# EasyEDA Pro project ProDocument_PCB_PCB_消毒盒3.0_2023-10-11_2023-10-12.epro

# Board PCB_PCB_消毒盒3.0_2023-10-11
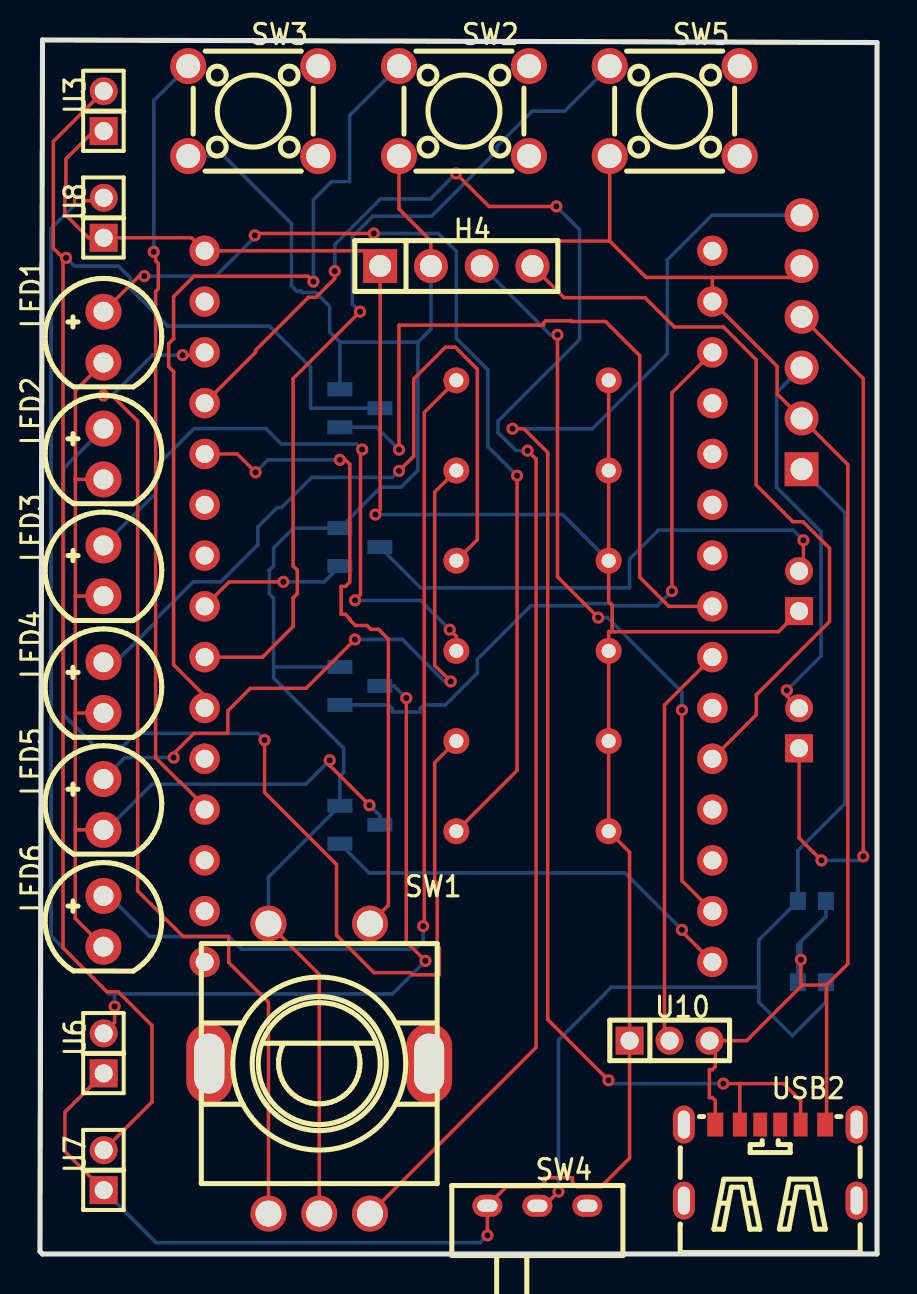
[diagram p0: board, top side]
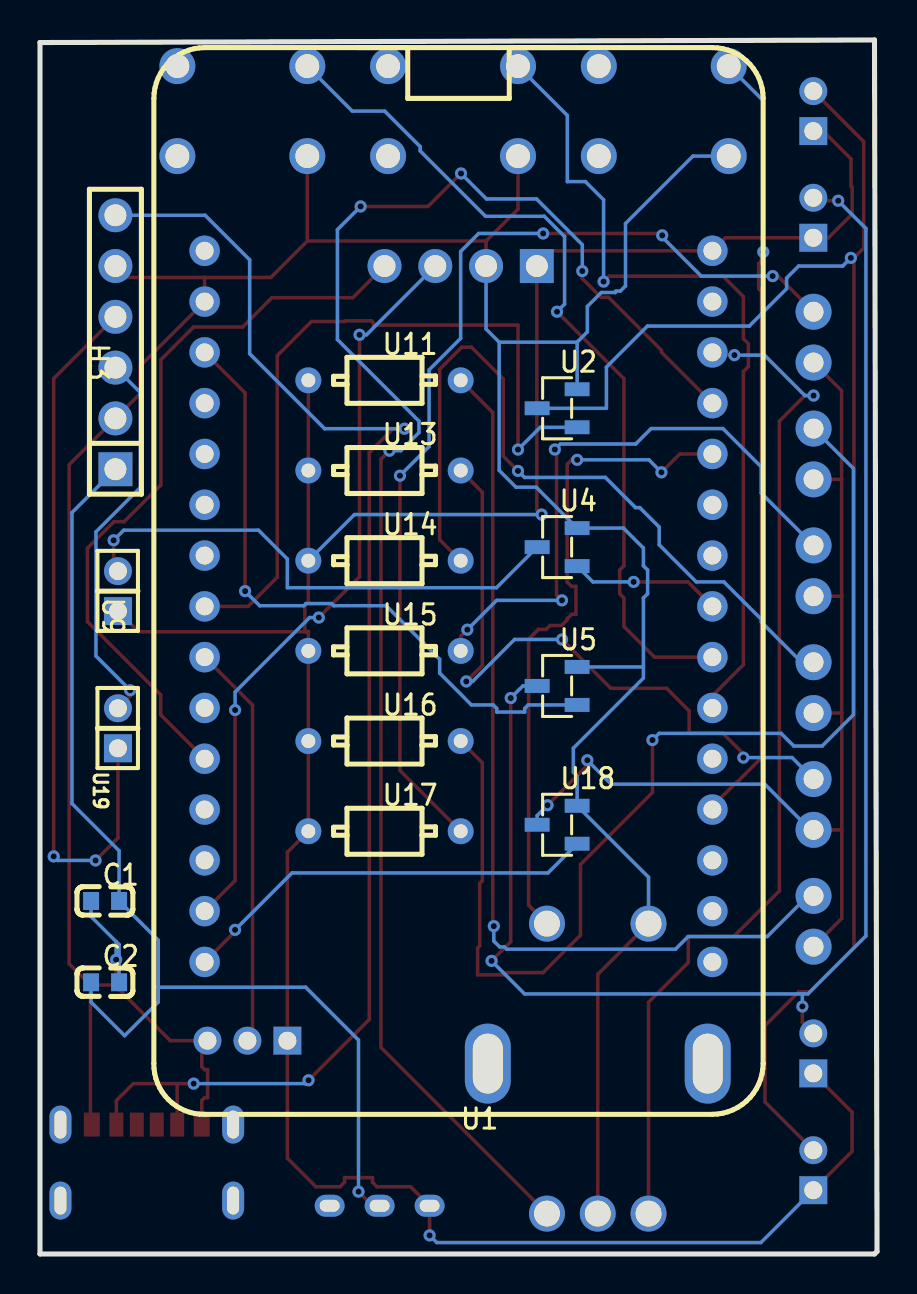
[diagram p1: board, bottom side, seen from below]

Outline 41.87 x 60.71 mm; copper layers: Top Layer, Bottom Layer. Coordinates in mm from the lower left corner of the outline.
Outline path: 0,0.13 0.12,58.77 0.13,60.71 41.87,60.58 41.87,0 0.13,0 0,0.13
Stack: Top Layer 0.035mm / Dielectric1 1.51mm FR4 er 4.5 / Bottom Layer 0.035mm

## Design rules (mm)
template: 用户自定义配置
spacing Default (default): track to track 0.152, other pairs 0 to 0.152
track width Default (default): min 0.178, default 0.178, max 25.4
differential pair differentialPair (default): width min 0.127, default 0.254, max 2.54; gap min 0.152, default 0.152
via Default (default): diameter min 0.61, default 0.61, max 100.025; hole min 0.305, default 0.305, max 59.995

## Placement (name value [footprint] x y rotation side)
C1  100nF  [C0603]  38.62 17.65 180 bottom
C2  10uF  [C0603]  38.62 13.59 180 bottom
H3  电源模块  [HDR-TH_6P-P2.54-V-M]  38.1 45.59 90 bottom
H4  1.3inch显示屏  [HDR-TH_4P-P2.54-V-M]  20.83 49.4 0 top
LED1  XL-502UBD  [LED-TH_BD5.9-P2.54-RD_BLUE]  3.17 45.85 90 top
LED2  XL-502UBD  [LED-TH_BD5.9-P2.54-RD_BLUE]  3.17 40 90 top
LED3  XL-502UBD  [LED-TH_BD5.9-P2.54-RD_BLUE]  3.17 34.16 90 top
LED4  XL-502UBD  [LED-TH_BD5.9-P2.54-RD_BLUE]  3.17 28.32 90 top
LED5  XL-502UBD  [LED-TH_BD5.9-P2.54-RD_BLUE]  3.17 22.48 90 top
LED6  XL-502UBD  [LED-TH_BD5.9-P2.54-RD_BLUE]  3.17 16.64 90 top
SW1  编码器  [SW-TH_EC11E18244A5]  13.97 9.27 0 top
SW2  B3F-1022  [SW-TH_4P-L6.0-W6.0-P4.50-LS6.5]  21.21 57.15 0 top
SW3  B3F-1022  [SW-TH_4P-L6.0-W6.0-P4.50-LS6.5]  10.67 57.15 0 top
SW4  总电源开关  [SW-TH_MK-12D18-G040]  24.88 2.41 0 top
SW5  B3F-1022  [SW-TH_4P-L6.0-W6.0-P4.50-LS6.5]  31.75 57.15 0 top
U1  NO  [ESP-WROOM-32]  8.24 14.6 0 bottom
U2  蓝色灯条MOS  [SOT-23-3_L2.9-W1.3-P1.90-LS2.4-BR]  16 42.29 180 bottom
U3  蓝色灯条  [HDR-TH_2P-P2.00-V-M]  3.19 57.15 90 top
U4  臭氧MOS  [SOT-23-3_L2.9-W1.3-P1.90-LS2.4-BR]  16 35.35 180 bottom
U5  白色灯条MOS  [SOT-23-3_L2.9-W1.3-P1.90-LS2.4-BR]  16 28.41 180 bottom
U6  白色灯条  [HDR-TH_2P-P2.00-V-M]  3.19 10.03 90 top
U7  蓝色灯条  [HDR-TH_2P-P2.00-V-M]  3.19 4.19 90 top
U8  白色灯条  [HDR-TH_2P-P2.00-V-M]  3.19 51.82 90 top
U9  臭氧  [HDR-TH_2P-P2.00-V-M]  37.97 33.15 90 bottom
U10  人体感应器  [HDR-TH_3P-P2.00-V-M]  31.5 10.67 0 top
U11  220Ω  [RES-TH_BD2.3-L3.7-P7.70-D0.9]  24.64 43.69 180 bottom
U13  220Ω  [RES-TH_BD2.3-L3.7-P7.70-D0.9]  24.64 39.18 180 bottom
U14  220Ω  [RES-TH_BD2.3-L3.7-P7.70-D0.9]  24.64 34.67 180 bottom
U15  220Ω  [RES-TH_BD2.3-L3.7-P7.70-D0.9]  24.64 30.16 180 bottom
U16  220Ω  [RES-TH_BD2.3-L3.7-P7.70-D0.9]  24.64 25.65 180 bottom
U17  220Ω  [RES-TH_BD2.3-L3.7-P7.70-D0.9]  24.64 21.14 180 bottom
U18  5N10_C5358569  [SOT-23-3_L2.9-W1.3-P1.90-LS2.4-BR]  16 21.46 180 bottom
U19  电池  [HDR-TH_2P-P2.00-V-M]  37.97 26.29 90 bottom
USB2  TYPE-C-2.0-6PIN  [TYPE-C-SMD_TYPE-C-6P-2]  36.53 4.57 0 top

## Footprints (pads in the part's own frame, mm; a bottom-side part is the same pattern mirrored in y, then rotated)
C0603
  rect 0.8x0.9 smd: 1(-0.7,0) 2(0.7,0)
ESP-WROOM-32
  round 1.524 hole 0.9: 1(0,0) 2(0,-2.54) 3(0,-5.08) 4(0,-7.62) 5(0,-10.16) 6(0,-12.7) 7(0,-15.24) 8(0,-17.78) 9(0,-20.32) 10(0,-22.86) 11(0,-25.4) 12(0,-27.94) 13(0,-30.48) 14(0,-33.02) 15(0,-35.56) 16(25.4,-35.56) 17(25.4,-33.02) 18(25.4,-30.48) 19(25.4,-27.94) 20(25.4,-25.4) 21(25.4,-22.86) 22(25.4,-20.32) 23(25.4,-17.78) 24(25.4,-15.24) 25(25.4,-12.7) 26(25.4,-10.16) 27(25.4,-7.62) 28(25.4,-5.08) 29(25.4,-2.54) 30(25.4,0)
HDR-TH_2P-P2.00-V-M
  rect 1.4x1.4 hole 0.9: 1(-1,0)
  round 1.4 hole 0.9: 2(1,0)
HDR-TH_3P-P2.00-V-M
  rect 1.4x1.4 hole 0.9: 1(-2,0)
  round 1.4 hole 0.9: 2(0,0) 3(2,0)
HDR-TH_4P-P2.54-V-M
  rect 1.7x1.7 hole 1.1: 1(-3.81,0)
  round 1.7 hole 1.1: 2(-1.27,0) 3(1.27,0) 4(3.81,0)
HDR-TH_6P-P2.54-V-M
  rect 1.7x1.7 hole 1.1: 1(-6.35,0)
  round 1.7 hole 1.1: 2(-3.81,0) 3(-1.27,0) 4(1.27,0) 5(3.81,0) 6(6.35,0)
LED-TH_BD5.9-P2.54-RD_BLUE
  round 1.8 hole 1: 1(-1.27,0) 2(1.27,0)
RES-TH_BD2.3-L3.7-P7.70-D0.9
  round 1.3 hole 0.7: 1(-3.81,0) 2(3.81,0)
SOT-23-3_L2.9-W1.3-P1.90-LS2.4-BR
  rect 1.25x0.7 smd: 1(1,-0.95) 2(1,0.95) 3(-1,0)
SW-TH_4P-L6.0-W6.0-P4.50-LS6.5
  round 1.8 hole 1.2: 1(-3.25,2.25) 2(3.25,2.25) 3(-3.25,-2.25) 4(3.25,-2.25)
SW-TH_EC11E18244A5
  oval 2.3x4 hole 1.5x3: 6(5.5,0.25) 7(-5.5,0.25)
  round 1.8 hole 1.3: A(-2.54,-7.25) B(2.54,-7.25) C(0,-7.25) D(-2.54,7.25) E(2.54,7.25)
SW-TH_MK-12D18-G040
  oval 1.5x1.1 hole 1x0.6: 1(-2.5,0) 2(0,0) 3(2.5,0)
TYPE-C-SMD_TYPE-C-6P-2
  oval 1.1x1.9 hole 0.6x1.4: 7(-4.32,1.9) 8(4.32,1.9) 9(-4.32,-1.9) 10(4.32,-1.9)
  rect 0.7x1.2 smd: A5(-0.5,1.9) A9(1.52,1.9) B5(0.5,1.9) B9(-1.52,1.9)
  rect 0.8x1.2 smd: A12(2.75,1.9) B12(-2.75,1.9)

## Nets
GND: C1.1 C2.2 H3.2 H3.5 H4.2 SW1.C SW1.D SW2.3 SW3.3 SW5.3 U1.17 U2.2 U4.2 U5.2 U10.3 U18.2 USB2.A12 USB2.B12
VCC: H4.1 SW4.1 U1.15 U3.1 U6.1 U7.1 U8.1 U9.1 U10.1 U11.1 U13.1 U14.1 U15.1 U16.1 U17.1
$1N52: U1.24 U10.2
$1N53: H4.4 U1.26
$1N54: H4.3 U1.29
$1N74: U1.23 U2.1
$1N90: U2.3 U3.2 U7.2
$1N112: U1.8 U4.1
$1N132: U1.18 U5.1
$1N148: U5.3 U6.2 U8.2
$1N216: U4.3 U9.2
$1N227: SW1.A U1.13
$1N228: SW1.B U1.12
$1N229: H3.6 USB2.A9 USB2.B9
$1N265: C1.2 C2.1 H3.1 SW4.2
$1N269: H3.3 U19.2
$1N380: SW1.E U1.11
$1N404: LED1.1 LED2.1 LED3.1 LED4.1 LED5.1 LED6.1 U18.3
$1N605: U1.30 U18.1
$1N699: SW2.1 U1.6
$1N700: SW5.1 U1.7
$1N701: SW3.1 U1.4
$1N710: LED6.2 U11.2
$1N711: LED5.2 U13.2
$1N712: LED4.2 U14.2
$1N713: LED3.2 U15.2
$1N714: LED2.2 U16.2
$1N715: LED1.2 U17.2
$1N1385: H3.4 U19.1

Pads without a net: SW1 6 7; SW2 2 4; SW3 2 4; SW4 3; SW5 2 4; U1 1 2 3 5 9 10 14 16 19 20 21 22 25 27 28; USB2 7 8 9 10 A5 B5

## Via types
v1: diameter 0.61, hole 0.305, Top Layer to Bottom Layer, 49 vias

## Routing (per net, layer and track width the routed paths; a pad name or vN(x,y) marks a point on that pad's centre or on a via; arc(x,y) is an arc through that point)
GND: length 174.5
  Top Layer w0.178: 38.14,13.45 39.35,13.45 ; 38.14,13.45 38.06,13.52 v1(38.06,14.72) ; 38.14,13.45 35.35,10.67 33.78,10.67 ; 39.35,13.45 40.41,14.51 40.41,39.47 H3.2 36.88,43.01 36.88,44.39 U1.17 33.64,48.83 ; 39.35,13.45 39.35,6.54 USB2.A12 ; 11.43,16.52 13.97,13.98 SW1.C ; 33.64,48.83 30.32,48.83 28.5,50.65 ; 33.64,48.83 37.53,48.83 H3.5 ; 33.78,10.67 33.78,9.36 33.63,9.22 33.49,9.22 33.49,7.82 33.63,7.82 33.78,7.67 USB2.B12 ; 33.78,10.67 U10.3 ; SW2.3 17.96,52.25 19.56,50.65 ; H4.2 19.56,50.65 ; 19.56,50.65 28.5,50.65 ; 28.5,50.65 SW5.3
  Bottom Layer w0.178: 18.9,45.6 19.56,46.25 H4.2 ; 18.9,45.6 15,45.6 ; 18.9,45.6 18.9,39.19 18.06,38.34 17.05,38.34 U4.2 12.68,36.3 11.69,35.3 11.69,34.41 11.48,34.2 11.48,33.02 11.69,32.8 11.69,29.36 ; U5.2 11.69,29.36 ; 11.69,29.36 11.69,28.8 15.19,25.29 15.19,24.09 15,23.9 U18.2 11.43,18.84 11.43,16.52 ; 38.06,15.62 39.32,16.87 C1.1 ; 38.06,15.62 v1(38.06,14.72) ; 38.06,15.62 37.92,15.47 C2.2 ; 15,45.6 14.49,46.11 14.49,47.38 13.79,48.08 13.09,48.08 13.09,48.12 13.06,48.15 12.84,48.15 12.58,48.41 12.58,51.53 9.21,54.9 SW3.3 ; 15,45.6 U2.2
VCC: length 134.9
  Top Layer w0.178: 28.45,31.11 28.46,31.13 28.62,31.13 28.62,32.43 28.45,32.61 U14.1 U13.1 U11.1 ; 28.45,31.11 U16.1 U17.1 29.5,20.09 U10.1 29.5,4.79 28.07,3.36 26.86,3.36 26.64,3.59 26.64,3.82 25.24,3.82 25.24,3.59 25.01,3.36 23.33,3.36 SW4.1 v1(22.38,0.93) ; 28.45,31.11 36.94,31.11 U9.1 ; 3.19,56.15 2.69,56.15 1.3,54.76 1.3,53.39 1.24,53.34 1.24,52 2.42,50.82 7.59,50.82 U1.15 16.26,50.16 H4.1 17.02,37.22 v1(16.78,36.98) ; 3.19,3.19 1.25,5.13 1.25,7.09 3.19,9.03
  Bottom Layer w0.178: v1(16.78,36.98) 26.14,36.98 U14.1 ; 3.19,3.19 5.81,0.57 22.02,0.57 v1(22.38,0.93)
$1N52: length 20.3
  Top Layer w0.178: U10.2 31.24,10.92 31.24,27.45 33.64,29.84
$1N53: length 37.3
  Top Layer w0.178: 24.64,49.4 26.22,47.82 30.27,47.82 31.73,46.35 34.19,46.35 35.82,44.72 35.82,38.46 37.66,36.62 38.17,36.62 39.5,35.29 39.5,31.62 35.84,27.96 35.84,26.96 33.64,24.77
$1N54: length 37.5
  Top Layer w0.178: v1(27.93,31.82) 25.89,33.86 v1(25.89,45.96) ; U1.29 32.11,18.67 v1(32.11,27.2)
  Bottom Layer w0.178: v1(27.93,31.82) 28.39,31.82 32.11,28.1 v1(32.11,27.2) ; v1(25.89,45.96) 25.54,45.96 22.1,49.4
$1N74: length 37.9
  Top Layer w0.178: U1.23 31.46,32.38 30,33.84 30,44.92 28.29,46.63 26.6,46.63 26.57,46.66 25.3,46.66 25.19,46.56 25.19,46.45 17.96,46.45 v1(17.96,40.22)
  Bottom Layer w0.178: U2.1 16.84,41.34 v1(17.96,40.22)
$1N90: length 77.9
  Top Layer w0.178: v1(1.31,49.81) 1.15,49.81 ; 1.15,49.81 0.67,50.3 0.67,55.63 3.19,58.15 ; 1.15,49.81 1.15,15.31 3.35,13.11 3.92,13.11 5.6,11.42 5.6,7.61 3.19,5.19
  Bottom Layer w0.178: v1(1.31,49.81) 1.72,49.4 3.92,49.4 4.52,48.8 4.52,48.27 6.39,46.4 11.48,46.4 13.54,44.35 13.54,42.29 U2.3
$1N112: length 7.6
  Top Layer w0.178: v1(12.17,33.61) 9.46,33.61 U1.8
  Bottom Layer w0.178: v1(12.17,33.61) 14.21,33.61 U4.1
$1N132: length 32.7
  Top Layer w0.178: U1.18 31.61,43.06 v1(31.61,33.15)
  Bottom Layer w0.178: U5.1 17.45,27.46 17.63,27.28 17.63,27.1 19.02,27.1 19.02,27.28 19.2,27.46 20.29,27.46 21.88,29.05 21.88,29.74 24.55,32.41 27.17,32.41 27.28,32.52 28.57,32.52 28.68,32.41 30.88,32.41 v1(31.61,33.15)
$1N148: length 76.6
  Top Layer w0.178: v1(18.32,27.8) 18.32,15.61 v1(19.28,14.66) ; v1(3.73,12.38) 3.73,11.58 3.19,11.03 ; 3.19,52.82 3.04,52.67 v1(1.94,52.67)
  Bottom Layer w0.178: U5.3 17.72,28.41 v1(18.32,27.8) ; v1(1.94,52.67) 0.55,51.28 0.55,15.9 3.45,13 3.73,13 ; 3.73,13 17.63,13 v1(19.28,14.66) ; 3.73,13 v1(3.73,12.38)
$1N216: length 25.9
  Top Layer w0.178: U9.2 38.19,34.36 v1(38.19,35.69)
  Bottom Layer w0.178: U4.3 19.03,33.32 29.5,33.32 29.5,34.75 30.94,36.19 37.68,36.19 v1(38.19,35.69)
$1N227: length 51.9
  Top Layer w0.178: v1(7.14,44.95) 8.1,44.95 U1.13 ; v1(3.17,42.93) 3.61,42.93 4.89,41.65 4.89,18.15 7.16,15.88 9.44,15.88 9.44,14.58 11.43,12.59 11.43,2.02
  Bottom Layer w0.178: v1(7.14,44.95) 5.63,44.95 3.61,42.93 v1(3.17,42.93)
$1N228: length 81.2
  Top Layer w0.178: v1(24.39,40.17) 24.82,39.74 24.82,10.33 SW1.B ; v1(20.81,54.03) 22.46,52.38 v1(25.83,52.38) ; U1.12 10.78,45.09 10.78,45.19 13.43,47.84 13.81,47.84 14.75,48.78 v1(14.75,49.15)
  Bottom Layer w0.178: v1(20.81,54.03) 19.54,52.76 17.03,52.76 14.75,50.47 v1(14.75,49.15) ; v1(24.39,40.17) 23.82,40.17 22.91,41.08 22.91,41.65 27,45.73 27,51.22 v1(25.83,52.38)
$1N229: length 69.8
  Top Layer w0.178: 35.01,8.52 37.2,8.52 38.05,7.67 38.05,6.47 ; 35.01,8.52 USB2.B9 ; 35.01,8.52 v1(34.18,8.52) ; v1(28.44,8.69) 25.4,11.73 25.4,40.08 24.21,41.27 v1(23.64,41.27)
  Bottom Layer w0.178: H3.6 33.61,51.94 31.38,49.71 31.38,45.02 27.63,41.27 v1(23.64,41.27) ; v1(34.18,8.52) 28.61,8.52 v1(28.44,8.69)
$1N265: length 55.1
  Top Layer w0.178: v1(25.94,3.12) 25.23,2.41 SW4.2
  Bottom Layer w0.178: 35.96,13.34 35.96,15.69 C1.2 37.92,20.17 40.27,22.52 40.27,37.07 H3.1 ; 35.96,13.34 35.96,12.6 37.64,10.92 39.32,12.6 C2.1 ; 35.96,13.34 28.58,13.34 25.94,10.7 v1(25.94,3.12)
$1N269: length 19.4
  Top Layer w0.178: v1(37.36,28.19) 37.36,27.9 U19.2
  Bottom Layer w0.178: v1(37.36,28.19) 39.07,29.9 39.07,36.11 36.85,38.33 36.85,43.07 H3.3
$1N380: length 33.3
  Top Layer w0.178: v1(15,39.71) 15.28,39.71 15.5,39.49 15.5,33.6 15.28,33.38 15.06,33.38 15.06,31.99 15.28,31.99 15.5,31.77 15.5,31.71 15.78,31.43 16.36,31.43 16.55,31.23 16.94,31.23 17.43,30.75 17.43,17.44 SW1.E ; U1.11 9.87,40 v1(10.78,39.09)
  Bottom Layer w0.178: v1(15,39.71) 11.41,39.71 v1(10.78,39.09)
$1N404: length 53
  Top Layer w0.178: v1(16.48,22.44) 14.49,24.43 v1(14.49,24.69) ; 1.77,32.89 1.77,38.73 1.77,38.73 ; 1.77,32.89 LED3.1 ; 1.77,32.89 1.77,32.89 1.77,27.05 ; LED1.1 1.77,43.17 1.77,38.73 ; LED5.1 1.76,21.21 ; 1.76,21.21 1.76,16.78 3.17,15.37 ; 1.76,21.21 1.76,27.05 1.77,27.05 ; 1.77,38.73 LED2.1 ; 1.77,27.05 3.17,27.05
  Bottom Layer w0.178: v1(16.48,22.44) 17,21.92 U18.3 ; LED5.1 3.33,21.21 5.62,23.49 13.3,23.49 v1(14.49,24.69)
$1N605: length 21.1
  Top Layer w0.178: v1(32.11,16.21) 32.11,16.13 U1.30
  Bottom Layer w0.178: U18.1 16.46,19.06 29.27,19.06 v1(32.11,16.21)
$1N699: length 42
  Top Layer w0.178: v1(13.68,48.63) 13.41,48.89 7.7,48.89 6.69,47.88 6.69,45.77 6.44,45.52 6.44,44.37 6.69,44.13 6.69,29.46 8.24,27.91 U1.6
  Bottom Layer w0.178: v1(13.68,48.63) 13.68,52.72 14.59,53.62 15.49,53.62 15.49,56.93 SW2.1
$1N700: length 42.8
  Top Layer w0.178: v1(16.01,47.12) 12.66,43.77 12.66,34.41 12.87,34.2 12.87,33.02 12.66,32.8 12.66,31.38 11.13,29.84 8.24,29.84
  Bottom Layer w0.178: v1(16.01,47.12) 15.63,47.5 15.63,50.87 16.65,51.89 19.59,51.89 22.85,55.16 22.85,55.38 24.63,57.15 26.25,57.15 SW5.1
$1N701: length 39.5
  Top Layer w0.178: v1(5.69,50.11) 5.69,50.28 5.74,50.33 5.79,50.28 5.79,49.66 5.92,49.53 5.92,48.27 5.79,48.13 5.79,24.81 6.98,23.61 7.01,23.61 8.24,22.38 U1.4
  Bottom Layer w0.178: v1(5.69,50.11) 5.69,57.67 SW3.1
$1N710: length 46
  Top Layer w0.178: 20.83,43.69 19.22,42.08 19.22,16.45 v1(19.17,16.4)
  Bottom Layer w0.178: v1(19.17,16.4) 19.17,15.65 18.88,15.36 18.64,15.36 18.53,15.24 10.08,15.24 9.45,15.88 5.49,15.88 3.46,17.91 LED6.2
$1N711: length 33.2
  Top Layer w0.178: v1(15.76,30.73) 13.32,28.29 10.52,28.29 9.4,27.16 9.4,26.03 7.7,26.03 6.69,25.02 v1(6.69,24.82) ; 20.83,39.18 19.74,38.09 19.74,29.43 v1(20.55,28.63)
  Bottom Layer w0.178: LED5.2 4.25,24.82 v1(6.69,24.82) ; v1(20.55,28.63) 20.23,28.63 18.13,30.73 v1(15.76,30.73)
$1N712: length 38.6
  Top Layer w0.178: 20.83,34.67 21.88,35.72 21.88,44.24 20.77,45.35 20.29,45.35 18.7,43.76 18.7,39.9 v1(17.96,39.16)
  Bottom Layer w0.178: v1(17.96,39.16) 17.64,38.83 13.59,38.83 12.08,37.32 11.87,37.32 10.9,36.35 10.9,35.46 9.04,33.61 7.66,33.61 5.79,31.74 5.79,31.6 3.78,29.59 LED4.2
$1N713: length 30.8
  Top Layer w0.178: 20.83,30.16 20.83,30.89 v1(20.5,31.22) ; v1(15.76,32.69) 16.03,32.96 16.03,40.14 v1(16.12,40.23)
  Bottom Layer w0.178: v1(16.12,40.23) 15.84,40.5 12.07,40.5 11.3,41.27 7.7,41.27 5.79,39.36 5.79,38.05 LED3.2 ; v1(20.5,31.22) 19.03,32.69 v1(15.76,32.69)
$1N714: length 55.7
  Top Layer w0.178: v1(11.23,25.7) 11.23,23.08 14.83,19.48 14.83,15.94 16.71,14.07 18.53,14.07 18.64,13.96 19.98,13.96 19.98,15.3 19.88,15.41 19.88,18.53 19.74,18.66 19.74,24.57 20.83,25.65
  Bottom Layer w0.178: v1(11.23,25.7) 10.9,26.03 4.8,26.03 4.16,25.4 2.74,25.4 1.18,26.96 1.18,39.28 LED2.2
$1N715: length 51.2
  Top Layer w0.178: v1(23.87,38.92) 23.87,24.18 20.83,21.14 ; v1(5.22,48.9) 4.96,48.9 LED1.2 ; v1(10.75,50.94) 10.84,51.03 v1(16.7,51.03)
  Bottom Layer w0.178: v1(10.75,50.94) 10.75,50.85 8.79,48.9 v1(5.22,48.9) ; v1(23.87,38.92) 22.41,40.38 22.41,44.21 20.83,45.79 20.83,50.13 19.93,51.03 v1(16.7,51.03)
$1N1385: length 36.5
  Top Layer w0.178: H3.4 41.19,43.78 v1(41.19,19.88) ; v1(39.09,19.68) 37.97,20.8 U19.1
  Bottom Layer w0.178: v1(39.09,19.68) 40.98,19.68 v1(41.19,19.88)
